# Altium project LV BMS.PrjPcb
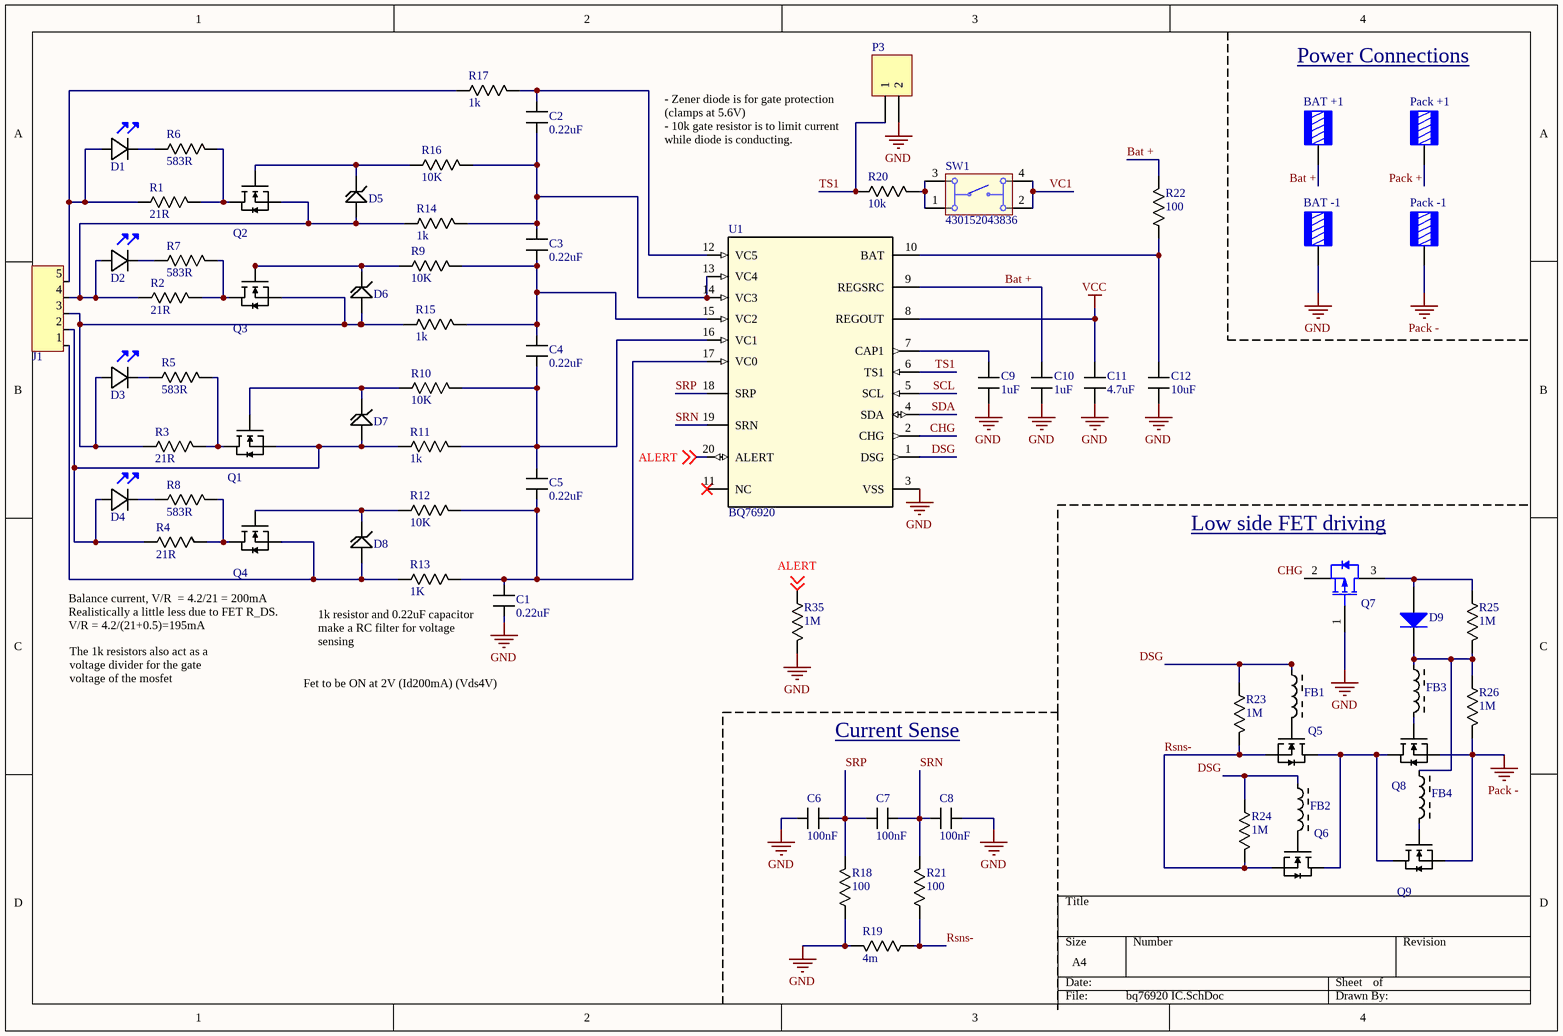
[diagram p0: bq76920 IC.SchDoc]
2 sheets, 96 parts. Net scope: global (net labels, ports and power ports of the same name join across sheets).
Board file: PCB_V1.PcbDoc
Sheets:
  bq76920 IC.SchDoc
  MCU.SchDoc

## Sheet bq76920 IC.SchDoc
size A4; SheetNumber: 1; SheetTotal: 2

### Parts
BAT_+1  7460305  [7460305]  (value not drawn)
BAT_-1  7460305  [7460305]  (value not drawn)
C1  value 0.22uF  [C_0603]  (hidden comment: C0603C224K3RECAUTO)
C2  value 0.22uF  [C_0603]  (hidden comment: C0603C224K3RECAUTO)
C3  value 0.22uF  [C_0603]  (hidden comment: C0603C224K3RECAUTO)
C4  value 0.22uF  [C_0603]  (hidden comment: C0603C224K3RECAUTO)
C5  value 0.22uF  [C_0603]  (hidden comment: C0603C224K3RECAUTO)
C6  value 100nF  [C_0603]  (hidden comment: C0603X104K5RAC7411)
C7  value 100nF  [C_0603]  (hidden comment: C0603X104K5RAC7411)
C8  value 100nF  [C_0603]  (hidden comment: C0603X104K5RAC7411)
C9  value 1uF  [C_0603]  (hidden comment: C0603C105K9RAC7411)
C10  value 1uF  [C_0603]  (hidden comment: CL10B105KA8VPNC)
C11  value 4.7uF  [C_0603]  (hidden comment: JMK107BB7475KA-T)
C12  Capacitance: 10uF  [C_0603]  (hidden comment: GRM188R6YA106MA73J)
D1  150060BS55040  [150060xS55040]  (value not drawn)
D2  150060BS55040  [150060xS55040]  (value not drawn)
D3  150060BS55040  [150060xS55040]  (value not drawn)
D4  150060BS55040  [150060xS55040]  (value not drawn)
D5  MMSZ5232BS-7-F  [MMSZ5232BS-7-F]  (value not drawn)
D6  MMSZ5232BS-7-F  [MMSZ5232BS-7-F]  (value not drawn)
D7  MMSZ5232BS-7-F  [MMSZ5232BS-7-F]  (value not drawn)
D8  MMSZ5232BS-7-F  [MMSZ5232BS-7-F]  (value not drawn)
D9  MMDL6050T1G  [ONSC-SOD-323-2-477-02_V]  (value not drawn)
FB1  BLM18SG221TN1D  [R-0603]  (value not drawn)
FB2  BLM18SG221TN1D  [R-0603]  (value not drawn)
FB3  BLM18SG221TN1D  [R-0603]  (value not drawn)
FB4  BLM18SG221TN1D  [R-0603]  (value not drawn)
J1  2-1445090-5  [2-1445090-5]  (value not drawn)
P3  For thermistor  [HDR1X2]  (value not drawn)
Pack_+1  7460305  [7460305]  (value not drawn)
Pack_-1  7460305  [7460305]  (value not drawn)
Q1  DMG1012T-13  [SOT-523-3]  (value not drawn)
Q2  DMG1012T-13  [SOT-523-3]  (value not drawn)
Q3  DMG1012T-13  [SOT-523-3]  (value not drawn)
Q4  DMG1012T-13  [SOT-523-3]  (value not drawn)
Q5  TK25S06N1L,LXHQ  [DPAK+]  (value not drawn)
Q6  TK25S06N1L,LXHQ  [DPAK+]  (value not drawn)
Q7  FDN5618P  [FAIR-SSOT3L-3_V]  (value not drawn)
Q8  TK25S06N1L,LXHQ  [DPAK+]  (value not drawn)
Q9  TK25S06N1L,LXHQ  [DPAK+]  (value not drawn)
R1  value 21R  [R_2512]  (hidden comment: CRCW251221R0FKEGHP)
R2  value 21R  [R_2512]  (hidden comment: CRCW251221R0FKEGHP)
R3  value 21R  [R_2512]  (hidden comment: CRCW251221R0FKEGHP)
R4  value 21R  [R_2512]  (hidden comment: CRCW251221R0FKEGHP)
R5  value 583R  [R-0603]  (hidden comment: RT0603DRE07583RL)
R6  value 583R  [R-0603]  (hidden comment: RT0603DRE07583RL)
R7  value 583R  [R-0603]  (hidden comment: RT0603DRE07583RL)
R8  value 583R  [R-0603]  (hidden comment: RT0603DRE07583RL)
R9  value 10K  [R-0603]  (hidden comment: CMP0603AFX-1002ELF)
R10  value 10K  [R-0603]  (hidden comment: CMP0603AFX-1002ELF)
R11  value 1k  [R-0603]  (hidden comment: CRCW06031K00FKEAC)
R12  value 10K  [R-0603]  (hidden comment: CMP0603AFX-1002ELF)
R13  value 1K  [R-0603]  (hidden comment: CRCW06031K00FKEAC)
R14  value 1k  [R-0603]  (hidden comment: CRCW06031K00FKEAC)
R15  value 1k  [R-0603]  (hidden comment: CRCW06031K00FKEAC)
R16  value 10K  [R-0603]  (hidden comment: CMP0603AFX-1002ELF)
R17  value 1k  [R-0603]  (hidden comment: CRCW06031K00FKEAC)
R18  value 100  [R-0603]  (hidden comment: RN73R1JTTD1000F50)
R19  value 4m  [PU3921FKM130R004L]  (hidden comment: PU3921FKM130R004L)
R20  value 10k  [R-0603]  (hidden comment: CMP0603AFX-1002ELF)
R21  value 100  [R-0603]  (hidden comment: RN73R1JTTD1000F50)
R22  value 100  [R-0603]  (hidden comment: RN73R1JTTD1000F50)
R23  value 1M  [R-0603]  (hidden comment: CRCW06031M00FKEAC)
R24  value 1M  [R-0603]  (hidden comment: CRCW06031M00FKEAC)
R25  value 1M  [R-0603]  (hidden comment: CRCW06031M00FKEAC)
R26  value 1M  [R-0603]  (hidden comment: CRCW06031M00FKEAC)
R35  value 1M  [R-0603]  (hidden comment: CRCW06031M00FKEAC)
SW1  430152043836  [430152043836]
U1  BQ76920  [TSSOP-20]

### Nets
GND: BAT_-1.1 C1.1 C6.2 C8.1 C9.1 C10.1 C11.1 C12.1 P3.2 Q7.1(GATE) R18.1 R19.2 R35.2 U1.3(VSS)
Pack -: Pack_-1.1 Q8.3(Source) Q9.3(Source) R26.2
VCC: C11.2 U1.8(REGOUT)
ALERT: R35.1 U1.20(ALERT) ; off-sheet ALERT
Bat +: BAT_+1.1 C10.2 R22.2 U1.9(REGSRC)
CHG: Q7.2(SOURCE) U1.2(CHG)
DSG: FB1.2 FB2.2 R23.1 R24.1 U1.1(DSG)
Pack +: Pack_+1.1
Rsns-: Q5.3(Source) Q6.3(Source) R19.1 R21.1 R23.2 R24.2
SCL: U1.5(SCL)
SDA: U1.4(SDA)
SRN: C7.1 C8.2 R21.2 U1.19(SRN)
SRP: C6.1 C7.2 R18.2 U1.18(SRP)
TS1: P3.1 R20.1 U1.6(TS1)
VC1: SW1.2 SW1.4
NetC1_2: C1.2 C5.1 R12.2 R13.2 U1.17(VC0)
NetC2_1: C2.1 C3.2 R14.2 R16.2 U1.13(VC4) U1.14(VC3)
NetC2_2: C2.2 R17.2 U1.12(VC5)
NetC3_1: C3.1 C4.2 R9.2 R15.2 U1.15(VC2)
NetC4_1: C4.1 C5.2 R10.2 R11.2 U1.16(VC1)
NetC9_2: C9.2 U1.7(CAP1)
NetC12_2: C12.2 R22.1 U1.10(BAT)
NetD1_1: D1.1(Cathode) R6.1
NetD1_2: D1.2(Anode) J1.5 R1.1 R17.1
NetD2_1: D2.1(Cathode) R7.1
NetD2_2: D2.2(Anode) D5.2(Anode_(+)) J1.4 Q2.2(Source) R2.1 R14.1
NetD3_1: D3.1(Cathode) R5.1
NetD3_2: D3.2(Anode) D6.2(Anode_(+)) J1.3 Q3.2(Source) R3.1 R15.1
NetD4_1: D4.1(Cathode) R8.1
NetD4_2: D4.2(Anode) D7.2(Anode_(+)) J1.2 Q1.2(Source) R4.1 R11.1
NetD5_1: D5.1(Cathode_(-)) Q2.1(Gate) R16.1
NetD6_1: D6.1(Cathode_(-)) Q3.1(Gate) R9.1
NetD7_1: D7.1(Cathode_(-)) Q1.1(Gate) R10.1
NetD8_1: D8.1(Cathode_(-)) Q4.1(Gate) R12.1
NetD8_2: D8.2(Anode_(+)) J1.1 Q4.2(Source) R13.1
NetD9_1: D9.1(K) FB3.2 FB4.2 R25.2 R26.1
NetD9_2: D9.2(A) Q7.3(DRAIN) R25.1
NetFB1_1: FB1.1 Q5.1(Gate)
NetFB2_1: FB2.1 Q6.1(Gate)
NetFB3_1: FB3.1 Q8.1(Gate)
NetFB4_1: FB4.1 Q9.1(Gate)
NetQ1_3: Q1.3(Drain) R3.2 R5.2
NetQ2_3: Q2.3(Drain) R1.2 R6.2
NetQ3_3: Q3.3(Drain) R2.2 R7.2
NetQ4_3: Q4.3(Drain) R4.2 R8.2
NetQ5_2: Q5.2(Drain) Q6.2(Drain) Q8.2(Drain) Q9.2(Drain)
NetR20_2: R20.2 SW1.1 SW1.3

Not connected (* = marked no-connect by the designer): U1 11(NC)*

### Notes on the sheet
- Power Connections
- - Zener diode is for gate protection (clamps at 5.6V)
  - 10k gate resistor is to limit current while diode is conducting.
- (near Q7) Low side FET driving
- Balance current, V/R  = 4.2/21 = 200mA
  Realistically a little less due to FET R_DS.
  V/R = 4.2/(21+0.5)=195mA
- 1k resistor and 0.22uF capacitor make a RC filter for voltage sensing
- The 1k resistors also act as a voltage divider for the gate voltage of the mosfet
- Fet to be ON at 2V (Id200mA) (Vds4V)
- Current Sense

### Library data of the parts
BAT_+1 BAT_-1 Pack_+1 Pack_-1 = 7460305: WP-BUTR Press-Fit with Internal thread, two rows, 9x9mm, 8 pins, M5x6mm, 160A; Pin Number: 8; Thread Length: 6mm; Thread: M5; Surface: Tin; ComponentLink1Description: Manufacturer; ComponentLink1URL: http://www.we-online.de; ComponentLink2Description: Datasheet; ComponentLink2URL: https://katalog.we-online.com/em/datasheet/7460305.pdf; Operating Temperature: -55 to +150degC; Height: 7mm; Material: Brass; Part Number: 7460305; Packaging: Bulk; Mounting Technology: Press-Fit; Rated Current: 160A; Publisher: Wurth Elektronik; Published Date: September 2019; Size: 9x9mm
C1-C5 = Capacitor: Cap Ceramic 0.22uF 25V X7R 10% Pad SMD 0603 125C Automotive T/R; Manufacturer: KEMET; Capacitance: 220nF; Supplier 1: Mouser; Supplier Part Number 1: 80-C0603C224K3REAUTO; Manufacturer Part Number: C0603C224K3RECAUTO; RoHS: Yes; Category: Ceramic Capacitors; Stock 1: 9648; Pricing 1: 1=0.27000, 10=0.12200, 50=0.12200, 100=0.10400, 1000=0.06400, 10000=0.05300 (USD); Mount: Surface Mount; Case/Package: 0603; Case Code (Imperial): 0603; Case Code (Metric): 1608; Min Operating Temperature: -55°C; Max Operating Temperature: 125°C; Packaging: Tape and Reel; Tolerance: 10%; Voltage Rating: 25V; Ratings: AEC-Q200; RoHS Compliant: Yes; ComponentLink1URL: http://www.farnell.com/datasheets/2314375.pdf?src-supplier=Farnell; ComponentLink1Description: http://www.farnell.com/datasheets/2314375.pdf?src-supplier=Farnell; ComponentLink2URL: https://api.kemet.com/component-edge/download/datasheet/C0603C224K3RECAUTO.pdf?src-supplier=Digi-Key; ComponentLink2Description: https://api.kemet.com/component-edge/download/datasheet/C0603C224K3RECAUTO.pdf?src-supplier=Digi-Key
C6-C8 = Capacitor: CAP CER 0.1UF 50V X7R 0603; Manufacturer: KEMET; Dielectric Material: Ceramic; Tolerance: 10%; Supplier 1: RSComponents; Supplier Part Number 1: 2053261; Manufacturer Part Number: C0603X104K5RAC7411; RoHS: Yes; Category: Ceramic Capacitors; Stock 1: 28600; Pricing 1: 15000=0.02900, 45000=0.02700 (USD); Mount: Surface Mount; Case/Package: 0603; Case Code (Metric): 1608; Case Code (Imperial): 0603; Min Operating Temperature: -55°C; Max Operating Temperature: 125°C; Capacitance: 100nF; Voltage Rating: 50V; Package Quantity: 1; Packaging: Cut Tape; Voltage Rating (DC): 50V; Features: Soft Termination; Length: 0.064inch; Width: 0.032inch; Thickness: 0.034inch; RoHS Compliant: Yes; ComponentLink1URL: https://api.kemet.com/component-edge/download/datasheet/C0603X104K5RAC7411.pdf?src-supplier=Digi-Key; ComponentLink1Description: https://api.kemet.com/component-edge/download/datasheet/C0603X104K5RAC7411.pdf?src-supplier=Digi-Key; ComponentLink2URL: http://www.farnell.com/datasheets/2747793.pdf?src-supplier=Newark; ComponentLink2Description: http://www.farnell.com/datasheets/2747793.pdf?src-supplier=Newark
C9 = Capacitor: Manufacturer: KEMET; ComponentLink1Description: New link; ComponentLink1URL: *; Supplier 1: Mouser; Supplier Part Number 1: 80-C0603C105K9R7411; Manufacturer Part Number: C0603C105K9RAC7411; RoHS: Yes; Stock 1: 22545; Pricing 1: 1=0.25000, 10=0.10200, 50=0.10200, 100=0.08700, 1000=0.05300, 10000=0.04400 (USD); RoHS Compliant: Yes
C10 = Capacitor: Cap Ceramic 1uF 25V X7R 10% Pad SMD 0603 125°C Automotive T/R; Manufacturer: KEMET; Manufacturer Part Number: C0603C105K9RAC7411; ComponentLink1Description: New link; ComponentLink1URL: *; Supplier 1: Mouser; Supplier Part Number 1: 80-C0603C105K9R7411; RoHS: Yes; Stock 1: 22545; Pricing 1: 1=0.25000, 10=0.10200, 50=0.10200, 100=0.08700, 1000=0.05300, 10000=0.04400 (USD); RoHS Compliant: Yes; Supplier 2: Mouser; Supplier Part Number 2: 187-CL10B105KA8VPNC; Category: Ceramic Capacitors; Stock 2: 72139; Pricing 2: 1=0.20000, 10=0.14500, 50=0.14500, 100=0.06900, 1000=0.04200, 10000=0.04000 (USD); Mount: Surface Mount; Case/Package: 0603; Case Code (Metric): 1608; Case Code (Imperial): 0603; Min Operating Temperature: -55°C; Max Operating Temperature: 125°C; Packaging: Tape and Reel; Capacitance: 1uF; Voltage Rating: 25V; Tolerance: 10%; Features: Soft Termination; Length: 0.063inch; Width: 0.031inch; Thickness: 0.035inch; Ratings: AEC-Q200; ComponentLink2URL: http://www.samsungsem.com/global/front/downloadcms.do?path=%2F%2Fglobal%2F%2Fsupport%2F%2Fproduct-search%2F%2Fmlcc%2F%2F__icsFiles%2F%2Fafieldfile%2F%2F2017%2F%2F05%2F%2F25&fileName=CL10B105KA8VPNC.pdf&src-supplier=Digi-Key; ComponentLink2Description: http://www.samsungsem.com/global/front/downloadcms.do?path=%2F%2Fglobal%2F%2Fsupport%2F%2Fproduct-search%2F%2Fmlcc%2F%2F__icsFiles%2F%2Fafieldfile%2F%2F2017%2F%2F05%2F%2F25&fileName=CL10B105KA8VPNC.pdf&src-supplier=Digi-Key; ComponentLink3URL: http://www.samsungsem.com/servlet/FileDownload?filename=productcatalog/pdf/MLCC.pdf&src-supplier=Avnet; ComponentLink3Description: http://www.samsungsem.com/servlet/FileDownload?filename=productcatalog/pdf/MLCC.pdf&src-supplier=Avnet
C11 = Capacitor: Cap Ceramic 4.7uF 6.3V X7R 10% Pad SMD 0603 125°C T/R; Manufacturer: Taiyo Yuden; ComponentLink1Description: New link; ComponentLink1URL: *; Supplier 1: Mouser; Supplier Part Number 1: 963-JMK107BB7475KA-T; Manufacturer Part Number: JMK107BB7475KA-T; RoHS: Yes; Category: Ceramic Capacitors; Stock 1: 75256; Pricing 1: 1=0.30000, 10=0.16700, 50=0.16700, 100=0.12200, 1000=0.10700, 10000=0.10100 (USD); Mount: Surface Mount; Case/Package: 0603; Case Code (Imperial): 0603; Case Code (Metric): 1608; Min Operating Temperature: -55°C; Max Operating Temperature: 125°C; Packaging: Cut Tape; Capacitance: 4.7uF; Tolerance: 10%; Voltage Rating: 6.3V; Lead Free: Lead Free; RoHS Compliant: Yes; ComponentLink2URL: http://www.farnell.com/datasheets/2801343.pdf?src-supplier=Farnell; ComponentLink2Description: http://www.farnell.com/datasheets/2801343.pdf?src-supplier=Farnell; ComponentLink3URL: http://ds.yuden.co.jp/TYCOMPAS/ut/detail.do?productNo=JMK107BB7475KA-T&fileName=JMK107BB7475KA-T_SS&mode=specSheetDownload&src-supplier=Digi-Key; ComponentLink3Description: http://ds.yuden.co.jp/TYCOMPAS/ut/detail.do?productNo=JMK107BB7475KA-T&fileName=JMK107BB7475KA-T_SS&mode=specSheetDownload&src-supplier=Digi-Key; ComponentLink4URL: https://ds.yuden.co.jp/TYCOMPAS/ut/detail?pn=JMK107BB7475KA-T &u=M&src-supplier=Digi-Key; ComponentLink4Description: https://ds.yuden.co.jp/TYCOMPAS/ut/detail?pn=JMK107BB7475KA-T &u=M&src-supplier=Digi-Key; ComponentLink5URL: http://www.farnell.com/datasheets/2801343.pdf?src-supplier=Element14; ComponentLink5Description: http://www.farnell.com/datasheets/2801343.pdf?src-supplier=Element14; ComponentLink6URL: http://www.farnell.com/datasheets/2801343.pdf?src-supplier=Newark; ComponentLink6Description: http://www.farnell.com/datasheets/2801343.pdf?src-supplier=Newark
C12 = Capacitor: CAP CER 10UF X5R 0603; Manufacturer: Murata; Tolerance: 20%; Voltage Rating: 35V; Supplier 1: Mouser; Supplier Part Number 1: 81-GRM188R6YA106MA3J; Manufacturer Part Number: GRM188R6YA106MA73J; RoHS: Yes; Category: Ceramic Capacitors; Stock 1: 9408; Pricing 1: 1=0.43000, 10=0.21100, 50=0.21100, 100=0.18100, 1000=0.11500, 10000=0.09300 (USD); Mount: Surface Mount; Case/Package: 0603; Min Operating Temperature: -55°C; Max Operating Temperature: 85°C; Packaging: Tape and Reel; RoHS Compliant: Yes; ComponentLink1URL: https://search.murata.co.jp/Ceramy/image/img/A01X/G101/ENG/GRM188R6YA106MA73-01A.pdf?src-supplier=Digi-Key; ComponentLink1Description: https://search.murata.co.jp/Ceramy/image/img/A01X/G101/ENG/GRM188R6YA106MA73-01A.pdf?src-supplier=Digi-Key
D1-D4 = 150060BS55040: LED BLUE DIFFUSED 0603 SMD; Manufacturer: Wurth Electronics; Lens Style: Flat; Luminous Intensity: 80mcd; Forward Voltage: 3.2V; Test Current: 20mA; Viewing Angle: 140°; Dominant Wavelength: 470nm; Lens Size: 0.8mm; Supplier 1: Mouser; Manufacturer Part Number: 150060BS55040; RoHS: No; Pricing 1: 1=0.18000, 10=0.16200, 50=0.13200, 100=0.11700, 1000=0.08800, 10000=0.08800 (USD); Mount: Surface Mount; Case/Package: 0603; Color: Blue; Packaging: Tape and Reel; Lens Transparency: Diffused; Length: 1.6mm; Width: 0.8mm; Height: 0.5mm; RoHS Compliant: No; ComponentLink1URL: http://www.farnell.com/datasheets/2621640.pdf?src-supplier=Farnell; ComponentLink1Description: http://www.farnell.com/datasheets/2621640.pdf?src-supplier=Farnell; ComponentLink2URL: https://www.we-online.de/web/en/index.php/download/media/07_electronic_components/download_center_1/application_notes_berichte/ano002_leds___the_future_of_horticultural_lighting/ANO002b_EN_LEDs_The_Future_of_Horticultural_Lighting.pdf?src-supplier=Digi-Key; ComponentLink2Description: https://www.we-online.de/web/en/index.php/download/media/07_electronic_components/download_center_1/application_notes_berichte/ano002_leds___the_future_of_horticultural_lighting/ANO002b_EN_LEDs_The_Future_of_Horticultural_Lighting.pdf?src-supplier=Digi-Key; ComponentLink3URL: https://katalog.we-online.de/pbs/datasheet/150060BS55040.pdf?src-supplier=Digi-Key; ComponentLink3Description: https://katalog.we-online.de/pbs/datasheet/150060BS55040.pdf?src-supplier=Digi-Key; Supplier Part Number 1: 710-150060BS55040
D5-D8 = MMSZ5232BS-7-F: Balance Diode / MMSZ5232BS-7-F
D9 = CMP-1054-00066-1: Switching Diode, 2-Pin SOD-323, Pb-Free, Tape and Reel; Manufacturer: On Semiconductor; trr Max (ns): 4; Configuration: Single; IF Max (A): 0.2; ComponentLink2Description: Datasheet; ComponentLink3URL: http://www.onsemi.com/pub_link/Collateral/477-02.PDF.1; PackageVersion: Rev. H, 03/2007; Mounting Technology: Surface Mount; Packing: Tape and Reel; ComponentLink1URL: http://www.onsemi.com/; ComponentLink1Description: Manufacturer URL; PartNumber: MMDL6050T1G; PackageDescription: 2-Pin SOD, Body 1.7 x 1.25 mm; ComponentLink2URL: http://www.onsemi.cn/pub_link/Collateral/MMDL6050T1-D.PDF; DatasheetVersion: Rev. 5; PackageReference: SOD-323-2-477-02; ComponentLink3Description: Package Specification; RoHS: TRUE
FB1-FB4 = BLM18SG221TN1D: FERRITE BEAD 220 OHM 0603 1LN; Manufacturer: Murata; Material: Ferrite,Steel; Impedance: 220R; Tolerance: 25%; DC Resistance (DCR): 40mR; Max DC Current: 2.5A; Number of Lines: 1; Test Frequency: 100MHz; Supplier 1: Mouser; Manufacturer Part Number: BLM18SG221TN1D; RoHS: Yes; Category: Inductors; Stock 1: 126991; Pricing 1: 1=0.13000, 10=0.07500, 50=0.07500, 100=0.05100, 1000=0.03800, 10000=0.03000 (USD); Case/Package: 0603; Number of Pins: 2; Core Material: Ferrite; Case Code (Metric): 1608; Case Code (Imperial): 0603; Weight: 7.1E-05oz; Min Operating Temperature: -55°C; Max Operating Temperature: 125°C; Package Quantity: 1; Max Current Rating: 2.5A; Packaging: Tape and Reel; Current Rating: 2.5A; Termination: SMD/SMT; DC Current: 2.5A; Number of Circuits: 1; Series: BLM18S; DC Resistance-Max: 40mR; Length: 1.6mm; Width: 0.8mm; Height: 0.8mm; Depth: 0.95mm; Radiation Hardening: No; REACH SVHC: No SVHC; Lead Free: Lead Free; RoHS Compliant: Yes; Supplier Part Number 1: 81-BLM18SG221TN1D
J1 = 2-1445090-5: Micro MATE-N-LOK, Rectangular Power Connectors, Header, Plug, Wire-to-Board, 5 Position, 3mm [.118in] Centerline, Printed Circuit Board, UL 94V-0; Manufacturer: TE Connectivity; Number of Positions: 5; Connector Type: Pin; Mating Retention: Yes (With); PCB Mount Alignment: No (Without); VDE Tested: Yes; PCB Mount Retention: With; PCB Mounting Orientation: Right Angle; Contact Current Rating: 5A; Pitch: 0.118inch; Plating Thickness: 2.54um; PCB Thickness: 0.062mm; Approvals: CSA; Supplier 1: Mouser; Manufacturer Part Number: 2-1445090-5; RoHS: Yes; Category: Connectors; Stock 1: 62; Pricing 1: 1=1.73000, 10=1.41000, 50=1.41000, 100=1.22000, 1000=0.95800, 10000=0.77900 (USD); Mount: Surface Mount; Color: Black; Contact Material: Brass; Housing Color: Black; Housing Material: Nylon; Contact Plating: Gold,Tin; Min Operating Temperature: -40°C; Max Operating Temperature: 221°C; Packaging: Tray; Package Quantity: 215; Number of Rows: 1; Fastening Type: Ramp; Termination: SMD/SMT; Number of Contacts: 5; Orientation: Right Angle; Series: Micro MATE-N-LOK; Contact Type: Male Pin; Connector System: Wire-to-Board; Contact Retention: No (Without); Sealable: No (Without); Circuit Application: Power; Mating Alignment: Yes (With); Number of Power Positions: 5; Strain Relief: No (Without); Length: 19mm; Width: 3.86mm; Height: 8.11mm; Insulation Diameter: 3mm; Radiation Hardening: No; Lead Free: Lead Free; ELV: Compliant; Flammability Rating: UL94 V-0; RoHS Compliant: Yes; ComponentLink1URL: https://datasheet.ciiva.com/9441/eng-cs-82181-softshell-high-density-0508-9441612.pdf?src-supplier=Avnet; ComponentLink1Description: https://datasheet.ciiva.com/9441/eng-cs-82181-softshell-high-density-0508-9441612.pdf?src-supplier=Avnet; ComponentLink2URL: https://datasheet.ciiva.com/729/eng-cd-1445090-b-729471.pdf?src-supplier=Digi-Key; ComponentLink2Description: https://datasheet.ciiva.com/729/eng-cd-1445090-b-729471.pdf?src-supplier=Digi-Key; Supplier Part Number 1: 571-2-1445090-5
P3 = Header 2: Header, 2-Pin; LatestRevisionDate: 17-Jul-2002; LatestRevisionNote: Re-released for DXP Platform.; Publisher: Altium Limited
Q1-Q4 = DMG1012T-13: Trans Mosfet N-ch 20V 0.63A 3-PIN SOT-523 T/r; Manufacturer: Diodes; Continuous Drain Current (ID): 630mA; Rds On Max: 400mR; Input Capacitance: 60.67pF; Max Power Dissipation: 280mW; Supplier 1: Mouser; Manufacturer Part Number: DMG1012T-13; RoHS: Yes; Stock 1: 11363; Pricing 1: 1=0.41000, 10=0.19900, 50=0.19900, 100=0.09600, 1000=0.05700, 10000=0.03900 (USD); Mount: Surface Mount; Case/Package: SOT-523; Min Operating Temperature: -55°C; Max Operating Temperature: 150°C; Packaging: Tape and Reel; Drain to Source Voltage (Vdss): 20V; Supplier Part Number 1: 621-DMG1012T-13
Q5 Q6 Q8 Q9 = TK25S06N1L,LXHQ: MOSFET 57W 1MHz Automotive; AEC-Q101; Manufacturer Part Number: TK25S06N1L,LQ(O; Manufacturer: Toshiba; Category: MOSFETs; RoHS: No; Stock 1: 5332; Pricing 1: 1=0.89000, 10=0.75400, 50=0.75400, 100=0.56000, 1000=0.39100, 10000=0.33300 (USD); Case/Package: DPAK+; Supplier 1: Digi-Key; Supplier Part Number 1: 264-TK25S06N1LLXHQCT-ND
Q7 = CMP-2000-06255-1: P-Channel Logic Level PowerTrench(R) MOSFET, -60 V, -1.25 A, 3-Pin SOT23, RoHS, Tape and Reel; Manufacturer: Fairchild Semiconductor; Current Temperature: 25°C; Voltage Vgs Max: 20V; Package Version: Rev. 3, 05/2015; Continuous Drain Current Id: 1.25A; Current Id Max: 1.2A; Voltage Vds: 60V; Pulse Current Idm: 10A; On Resistance Rds(on): 170mohm; Transistor Case Style: SOT-23; Voltage Vgs th Max: -3V; Rds(on) Test Voltage Vgs: -10V; Device Marking: 618; External Depth: 2.5mm; Transistor Polarity: PChannel; SVHC: NoSVHC(19-Dec-2012); External Width: 3.05mm; External Length / Height: 1.12mm; Power Dissipation Pd: 500mW; Voltage Vds Typ: -60V; No. of Pins: 3; Package / Case: SOT-23; Manufacturer URL: https://www.fairchildsemi.com/; Package Reference: SSOT3L; Operating Temperature Max: 150°C; Tape Width: 8mm; Package URL: https://www.fairchildsemi.com/package-drawings/MA/MA03B.pdf; Datasheet URL: https://www.fairchildsemi.com/datasheets/FD/FDN5618P.pdf; MSL: –; Operating Temperature Min: -55°C; Package Description: 3-Pin Small Outline Transistor, Body 2.92 x 1.4 mm, Pitch 0.95 mm; Datasheet Version: Rev. C, 10/2000; Threshold Voltage Vgs Typ: 20V; Drain Source Voltage Vds: 60V; SMD Marking: 618; Full Power Rating Temperature: 25°C; Mounting Technology: SurfaceMount; Voltage Vgs Rds on Measurement: -10V; Operating Temperature Range: -55°Cto+150°C
R1-R4 = Resistor: RES SMD 21 OHM 1% 1.5W 2512; Manufacturer: Vishay Dale; Temperature Coefficient: 100ppm/°C; Supplier 1: Mouser; Supplier Part Number 1: 71-CRCW251221R0FKEGH; Manufacturer Part Number: CRCW251221R0FKEGHP; RoHS: Yes; Category: Chip SMD Resistors; Stock 1: 1060; Pricing 1: 1=0.71000, 10=0.58900, 50=0.58900, 100=0.39600, 1000=0.23700, 10000=0.20600 (USD); Case/Package: 2512; Min Operating Temperature: -55°C; Max Operating Temperature: 155°C; Resistance: 21R; Package Quantity: 2000; Packaging: Tape and Reel; Tolerance: 1%; Resistor Type: Thick Film; Number of Terminations: 2; Max Power Dissipation: 1.5W; Features: Automotive AEC-Q200; Series: CRCW-HP; Length: 0.248inch; Width: 0.124inch; Height: 0.028inch; Lead Free: Lead Free; RoHS Compliant: Yes; ComponentLink1URL: http://www.vishay.com/docs/20043/crcwhpe3.pdf?src-supplier=Digi-Key; ComponentLink1Description: http://www.vishay.com/docs/20043/crcwhpe3.pdf?src-supplier=Digi-Key
R5-R8 = Resistor: High Precision-High Stability Chip Resistor Thin Film 0603 583Ohm 0.5% Paper T/R; Manufacturer: Yageo; Max Power Dissipation: 100mW; Temperature Coefficient: 50ppm/°C; Supplier 1: Mouser; Supplier Part Number 1: 603-RT0603DRE07583RL; Manufacturer Part Number: RT0603DRE07583RL; RoHS: Yes; Category: Chip SMD Resistors; Stock 1: 17347; Pricing 1: 1=0.14000, 10=0.07400, 50=0.07400, 100=0.02600, 1000=0.01900, 10000=0.01200 (USD); Case/Package: 0603; Min Operating Temperature: -55°C; Max Operating Temperature: 155°C; Resistor Type: Thin Film; Packaging: Tape and Reel; Number of Terminations: 2; Resistance: 583R; Tolerance: 0.5%; ComponentLink1URL: http://www.yageo.com/documents/recent/PYu-RT_1-to-0.01_RoHS_L_9.pdf?src-supplier=Digi-Key; ComponentLink1Description: http://www.yageo.com/documents/recent/PYu-RT_1-to-0.01_RoHS_L_9.pdf?src-supplier=Digi-Key
R9 R10 R12 R16 R20 = Resistor: Manufacturer: Bourns; Supplier 1: Mouser; Supplier Part Number 1: 652-CMP0603AFX-1002L; Manufacturer Part Number: CMP0603AFX-1002ELF; RoHS: No; Stock 1: 10216; Pricing 1: 1=0.21000, 10=0.09200, 50=0.09200, 100=0.05300, 1000=0.02900, 10000=0.02200 (USD)
R11 R13-R15 R17 = Resistor: VISHAY - CRCW06031K00FKEA - SMD Chip Resistor, 0603 [1608 Metric], 1 kohm, CRCW e3 Series, 75 V, Thick Film, 100 mW; Manufacturer: Vishay Dale; Resistance: 1kR; Power Rating: 100mW; Tolerance: 1%; Temperature Coefficient: 100ppm/°C; Voltage Rating: 75V; Supplier 1: RSComponents; Supplier Part Number 1: 1694265; Manufacturer Part Number: CRCW06031K00FKEA; RoHS: Yes; Category: Chip SMD Resistors; Stock 1: 30000; Pricing 1: 5000=0.00500, 10000=0.00400, 20000=0.00400 (USD); Mount: Surface Mount; Case/Package: 0603; Number of Pins: 2; Contact Plating: Tin; Weight: 7.1E-05oz; Case Code (Metric): 1608; Case Code (Imperial): 0603; Size Code: 0603; Min Operating Temperature: -55°C; Max Operating Temperature: 155°C; Resistor Type: Thick Film; Termination: SMD/SMT; Packaging: Tape and Reel; Package Quantity: 10; Number of Terminations: 2; Max Power Dissipation: 100mW; Voltage Rating (DC): 75V; Features: Automotive AEC-Q200; Series: CRCW; Technology: THICK FILM; Construction: Rectangular; Resistance Tolerance: 1%; Length: 1.55mm; Width: 0.033inch; Height: 0.45mm; Depth: 0.85mm; Radiation Hardening: No; Lead Free: Lead Free; RoHS Compliant: Yes; REACH SVHC: Unknown; Military Standard: Not; ComponentLink1URL: https://datasheet.ciiva.com/11808/0900766b80d98afc-11808625.pdf?src-supplier=RSComponents; ComponentLink1Description: https://datasheet.ciiva.com/11808/0900766b80d98afc-11808625.pdf?src-supplier=RSComponents; ComponentLink2URL: https://datasheet.ciiva.com/8336/dcrcwe3-8336822.pdf?src-supplier=Avnet; ComponentLink2Description: https://datasheet.ciiva.com/8336/dcrcwe3-8336822.pdf?src-supplier=Avnet; ComponentLink3URL: https://datasheet.ciiva.com/16515/dcrcwe3-16515078.pdf?src-supplier=Avnet+Asia; ComponentLink3Description: https://datasheet.ciiva.com/16515/dcrcwe3-16515078.pdf?src-supplier=Avnet+Asia; ComponentLink4URL: https://datasheet.ciiva.com/3257/dcrcwe3-3257132.pdf?src-supplier=Avnet; ComponentLink4Description: https://datasheet.ciiva.com/3257/dcrcwe3-3257132.pdf?src-supplier=Avnet; ComponentLink5URL: https://datasheet.ciiva.com/2465/dcrcwe3-2465534.pdf?src-supplier=Digi-Key; ComponentLink5Description: https://datasheet.ciiva.com/2465/dcrcwe3-2465534.pdf?src-supplier=Digi-Key; ComponentLink6URL: https://datasheet.ciiva.com/16893/dcrcwe3-16893742.pdf?src-supplier=Avnet+Europe; ComponentLink6Description: https://datasheet.ciiva.com/16893/dcrcwe3-16893742.pdf?src-supplier=Avnet+Europe; ComponentLink7URL: https://datasheet.ciiva.com/2465/dcrcwe3-2465535.pdf?src-supplier=Digi-Key; ComponentLink7Description: https://datasheet.ciiva.com/2465/dcrcwe3-2465535.pdf?src-supplier=Digi-Key; ComponentLink8URL: https://datasheet.ciiva.com/2465/dcrcwe3-2465536.pdf?src-supplier=Digi-Key; ComponentLink8Description: https://datasheet.ciiva.com/2465/dcrcwe3-2465536.pdf?src-supplier=Digi-Key; ComponentLink9URL: https://datasheet.ciiva.com/26316/fld-crcw-e3-data-en-26316551.pdf?src-supplier=Distrelec; ComponentLink9Description: https://datasheet.ciiva.com/26316/fld-crcw-e3-data-en-26316551.pdf?src-supplier=Distrelec; ComponentLink10URL: https://datasheet.ciiva.com/46441/1720486-46441623.pdf?src-supplier=Element14; ComponentLink10Description: https://datasheet.ciiva.com/46441/1720486-46441623.pdf?src-supplier=Element14; ComponentLink11URL: https://datasheet.ciiva.com/46441/1720486-46441622.pdf?src-supplier=Element14; ComponentLink11Description: https://datasheet.ciiva.com/46441/1720486-46441622.pdf?src-supplier=Element14; ComponentLink12URL: https://datasheet.ciiva.com/46385/1697337-46385497.pdf?src-supplier=Element14; ComponentLink12Description: https://datasheet.ciiva.com/46385/1697337-46385497.pdf?src-supplier=Element14; ComponentLink13URL: https://datasheet.ciiva.com/16199/dcrcwe3-16199053.pdf?src-supplier=Future+Electronics; ComponentLink13Description: https://datasheet.ciiva.com/16199/dcrcwe3-16199053.pdf?src-supplier=Future+Electronics
R18 R21 R22 = Resistor: Manufacturer: KOA Speer; Supplier 1: Mouser; Supplier Part Number 1: 660-RN73R1JTD1000F50; Manufacturer Part Number: RN73R1JTTD1000F50; RoHS: No; Stock 1: 4124; Pricing 1: 1=0.20000, 10=0.20000, 50=0.15200, 100=0.11800, 1000=0.07700, 10000=0.04700 (USD)
R19 = Resistor: Res Metal Plate 3921 0.004 Ohm 1% 3W ±75ppm/C Pad SMD Automotive T/R; Manufacturer: Yageo; Resistance: 4mR; Temperature Coefficient: 75ppm/°C; Supplier 1: Mouser; Supplier Part Number 1: 603-PU3921FKM130R004; Manufacturer Part Number: PU3921FKM130R004L; RoHS: Yes; Category: Chip SMD Resistors; Stock 1: 2383; Pricing 1: 1=1.40000, 10=1.14000, 50=1.14000, 100=0.75800, 1000=0.53100, 10000=0.45200 (USD); Case/Package: 3921; Min Operating Temperature: -65°C; Max Operating Temperature: 170°C; Packaging: Tape and Reel; Resistor Type: Metal Element; Number of Terminations: 2; Tolerance: 1%; Max Power Dissipation: 3W; Features: Moisture Resistant,Automotive AEC-Q200; Length: 0.394inch; Width: 0.205inch; Height: 0.019inch; RoHS Compliant: Yes; ComponentLink1URL: http://www.yageo.com/documents/recent/PYu-PU_51_RoHS_L_3.pdf?src-supplier=Digi-Key; ComponentLink1Description: http://www.yageo.com/documents/recent/PYu-PU_51_RoHS_L_3.pdf?src-supplier=Digi-Key
R23-R26 R35 = Resistor: Manufacturer: Vishay; Power Rating: 100mW; Resistance: 1MR; Temperature Coefficient: 100ppm/°C; Tolerance: 1%; Case/Package: Molded; Category: Chip SMD Resistors; Contact Plating: Tin; Lead Free: Lead Free; Length: 1.55mm; Manufacturer Part Number: CRCW06031M00FKEAC; Max Operating Temperature: 155°C; Min Operating Temperature: -55°C; Mount: Surface Mount; Resistor Type: Thick Film; RoHS Compliant: Yes; Termination: Wraparound
SW1 = CMP-1452-00002-1: WS-TASV SMD Tact Switch 6X6 mm; Manufacturer: Wuerth Elektronik; NoPins: 04; PartNumber: 430152043836; ComponentLink2URL: http://katalog.we-online.de/em/datasheet/4301x2.pdf; ComponentLink1URL: http://www.we-online.com; ComponentLink2Description: Datasheet; ComponentLink1Description: Manufacturer URL; PackageReference: 430152043836
U1 = BQ76920: 3 to 5-Series Cell Li-Ion and Li-Phosphate Battery Monitor; Manufacturer: Texas Instruments; Manufacturer Part Number: BQ7692003PWR; Fault Protection: Over Current,Short Circuit,Over/Under Voltage; Interface: I2C; Operating Supply Voltage: 25V; Output Voltage: 3.6V; Supplier 1: Mouser; Case/Package: TSSOP; Category: Battery Management; Contact Plating: Gold; Lead Free: Lead Free; Max Operating Temperature: 85°C; Min Operating Temperature: -40°C; Mount: Surface Mount; Number of Pins: 20; Package Quantity: 2000; Packaging: Tape and Reel; RoHS Compliant: Yes; Weight: 0.002758oz; Supplier Part Number 1: 595-BQ7692003PWR

## Sheet MCU.SchDoc
size A4; SheetNumber: 2; SheetTotal: 2
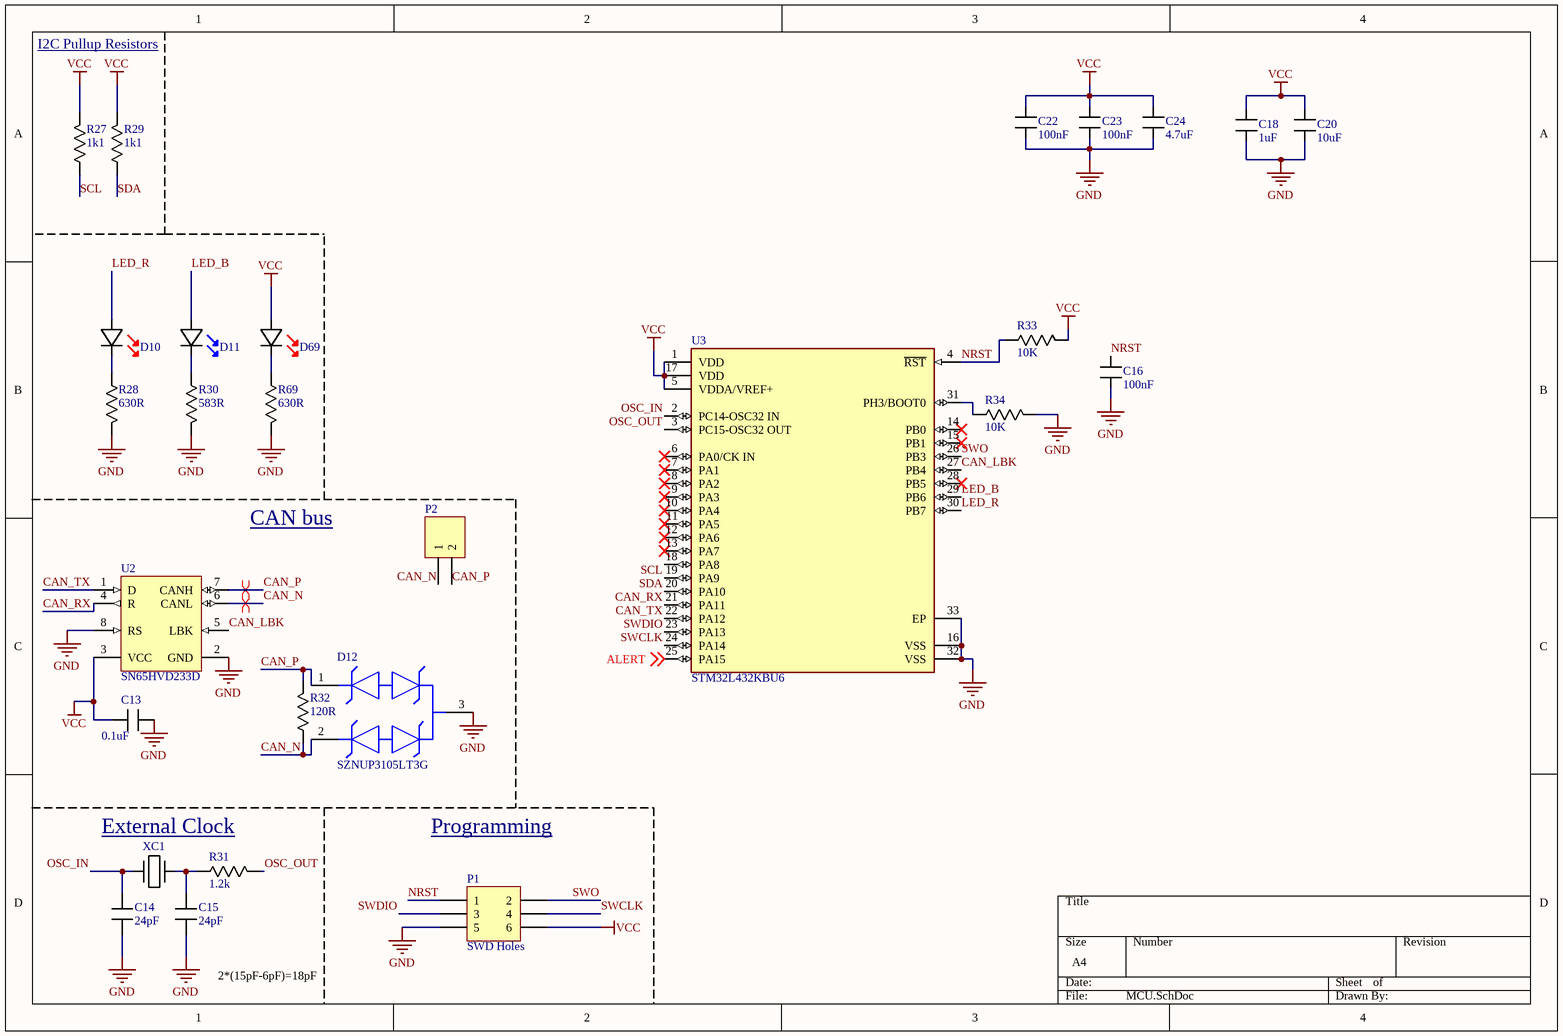
[diagram p1: MCU.SchDoc]

### Parts
C13  value 0.1uF  [C_0603]  (hidden comment: 06035C104JAT4A)
C14  value 24pF  [C_0603]  (hidden comment: 06031U240FAT2A)
C15  value 24pF  [C_0603]  (hidden comment: 06031U240FAT2A)
C16  value 100nF  [C_0603]  (hidden comment: C0603X104K5RAC7411)
C18  value 1uF  [C_0603]  (hidden comment: C0603C105K9RAC7411)
C20  value 10uF  [C_0603]  (hidden comment: JMK107ABJ106KAHT)
C22  value 100nF  [C_0603]  (hidden comment: C0603X104K5RAC7411)
C23  value 100nF  [C_0603]  (hidden comment: C0603X104K5RAC7411)
C24  value 4.7uF  [C_0603]  (hidden comment: JMK107BB7475KA-T)
D10  150060RS55040  [150060xS55040]  (value not drawn)
D11  150060BS55040  [150060xS55040]  (value not drawn)
D12  SZNUP3105LT3G  [FP-318-08-MFG]
D69  150060RS55040  [150060xS55040]  (value not drawn)
P1  SWD Holes  [2*3 2.54mm header]
P2  Nothing  [2x1 2.54MM PITCH]  (value not drawn)
R27  value 1k1  [R-0603]  (hidden comment: CRCW06031K10JNEAC)
R28  value 630R  [R-0603]  (hidden comment: RT0603DRE07583RL)
R29  value 1k1  [R-0603]  (hidden comment: CRCW06031K10JNEAC)
R30  value 583R  [R-0603]  (hidden comment: RT0603DRE07583RL)
R31  value 1.2k  [R-0603]  (hidden comment: Resistor)
R32  value 120R  [R-0603]  (hidden comment: Dont populate)
R33  value 10K  [R-0603]  (hidden comment: CMP0603AFX-1002ELF)
R34  value 10K  [R-0603]  (hidden comment: CMP0603AFX-1002ELF)
R69  value 630R  [R-0603]  (hidden comment: RT0603DRE07583RL)
U2  SN65HVD233D  [D0008A_N]
U3  STM32L432KBU6  [FP-UFQFPN32-A0B8-MFG]
XC1  ATS600BSM-1E  [ATS600BSM-1E]  (value not drawn)

### Nets
GND: C13.1 C14.1 C15.1 C16.1 C18.1 C20.1 C22.1 C23.1 C24.1 D12.3 P1.5 R28.2 R30.2 R34.2 R69.2 U2.2(GND) U2.8(RS) U3.16(VSS) U3.32(VSS) U3.33(EP)
VCC: C13.2 C18.2 C20.2 C22.2 C23.2 C24.2 D69.2(Anode) P1.6 R27.2 R29.2 R33.2 U2.3(VCC) U3.1(VDD) U3.5(VDDA/VREF+) U3.17(VDD)
ALERT: U3.25(PA15) ; off-sheet ALERT
CAN_LBK: U2.5(LBK) U3.27(PB4)
CAN_N: D12.2 P2.1 R32.1 U2.6(CANL)
CAN_P: D12.1 P2.2 R32.2 U2.7(CANH)
CAN_RX: U2.4(R) U3.21(PA11)
CAN_TX: U2.1(D) U3.22(PA12)
LED_B: D11.2(Anode) U3.29(PB6)
LED_R: D10.2(Anode) U3.30(PB7)
NRST: C16.2 P1.1 R33.1 U3.4(~{RST})
OSC_IN: C14.2 U3.2(PC14-OSC32_IN) XC1.1
OSC_OUT: R31.2 U3.3(PC15-OSC32_OUT)
SCL: R27.1 U3.19(PA9)
SDA: R29.1 U3.20(PA10)
SWCLK: P1.4 U3.24(PA14)
SWDIO: P1.3 U3.23(PA13)
SWO: P1.2 U3.26(PB3)
NetC15_2: C15.2 R31.1 XC1.1
NetD10_1: D10.1(Cathode) R28.1
NetD11_1: D11.1(Cathode) R30.1
NetD69_1: D69.1(Cathode) R69.1
NetR34_1: R34.1 U3.31(PH3/BOOT0)

Not connected (* = marked no-connect by the designer): U3 6(PA0/CK_IN)* 7(PA1)* 8(PA2)* 9(PA3)* 10(PA4)* 11(PA5)* 12(PA6)* 13(PA7)* 14(PB0)* 15(PB1)* 18(PA8) 28(PB5)*

### Layout directives
differential pair: CAN_N, CAN_P

### Notes on the sheet
- I2C Pullup Resistors
- CAN bus
- External Clock
- Programming
- (near C15) 2*(15pF-6pF)=18pF

### Library data of the parts
C13 = Capacitor: Manufacturer: Kyocera AVX; ComponentLink1Description: New link; ComponentLink1URL: *; Supplier 1: Mouser; Supplier Part Number 1: 581-06035C104JAT4A; Manufacturer Part Number: 06035C104JAT4A; RoHS: Yes; Category: Ceramic Capacitors; Stock 1: 26326; Pricing 1: 1=0.11000, 10=0.04300, 50=0.04300, 100=0.03500, 1000=0.02000, 10000=0.01400 (USD); RoHS Compliant: Yes
C14 C15 = Capacitor: Cap Ceramic 24pF 100V C0G 1% Pad SMD 0603 125°C Ultra Low ESR T/R; Manufacturer: Kyocera AVX; Temperature Coefficient: 30ppm/°C; ComponentLink1Description: New link; ComponentLink1URL: *; Supplier 1: Mouser; Supplier Part Number 1: 581-06031U240FAT2A; Manufacturer Part Number: 06031U240FAT2A; RoHS: Yes; Category: Ceramic Capacitors; Stock 1: 95996; Pricing 1: 1=0.41000, 10=0.28400, 50=0.28400, 100=0.16900, 1000=0.10700, 10000=0.07900 (USD); Mount: Surface Mount; Case/Package: 0603; Case Code (Metric): 1608; Case Code (Imperial): 0603; Weight: 7.1E-05oz; Min Operating Temperature: -55°C; Max Operating Temperature: 125°C; Capacitance: 24pF; Voltage Rating: 100V; Tolerance: 1%; Package Quantity: 4000; Packaging: Tape and Reel; Voltage Rating (DC): 100V; Dielectric: C0G; Termination: SMD/SMT; Resistor Type: Ceramic; Series: U; Construction: Flat; Length: 1.52mm; Width: 0.03inch; Thickness: 0.036inch; Depth: 0.76mm; Radiation Hardening: No; Lead Free: Lead Free; RoHS Compliant: Yes; ComponentLink2URL: https://datasheet.ciiva.com/208/useries-208498.pdf?src-supplier=Digi-Key; ComponentLink2Description: https://datasheet.ciiva.com/208/useries-208498.pdf?src-supplier=Digi-Key; ComponentLink3URL: https://datasheet.ciiva.com/11568/useries-11568149.pdf?src-supplier=Avnet; ComponentLink3Description: https://datasheet.ciiva.com/11568/useries-11568149.pdf?src-supplier=Avnet
C16 C22 C23 = Capacitor: as C6 on sheet bq76920 IC; Supplier 1: RSComponents; Supplier Part Number 1: 2053261; Manufacturer Part Number: C0603X104K5RAC7411; RoHS: Yes; Category: Ceramic Capacitors; Stock 1: 28600; Pricing 1: 15000=0.02900, 45000=0.02700 (USD); Mount: Surface Mount; Case/Package: 0603; Case Code (Metric): 1608; Case Code (Imperial): 0603; Min Operating Temperature: -55°C; Max Operating Temperature: 125°C; Capacitance: 100nF; Voltage Rating: 50V; Package Quantity: 1; Packaging: Cut Tape; Voltage Rating (DC): 50V; Features: Soft Termination; Length: 0.064inch; Width: 0.032inch; Thickness: 0.034inch; RoHS Compliant: Yes; ComponentLink1URL: https://api.kemet.com/component-edge/download/datasheet/C0603X104K5RAC7411.pdf?src-supplier=Digi-Key; ComponentLink1Description: https://api.kemet.com/component-edge/download/datasheet/C0603X104K5RAC7411.pdf?src-supplier=Digi-Key; ComponentLink2URL: http://www.farnell.com/datasheets/2747793.pdf?src-supplier=Newark; ComponentLink2Description: http://www.farnell.com/datasheets/2747793.pdf?src-supplier=Newark
C18 = Capacitor: Manufacturer: KEMET; Supplier 1: Mouser; Supplier Part Number 1: 80-C0603C105K9R7411; Manufacturer Part Number: C0603C105K9RAC7411; RoHS: Yes; Stock 1: 22716; Pricing 1: 1=0.25000, 10=0.10200, 50=0.10200, 100=0.08700, 1000=0.05300, 10000=0.04400 (USD); RoHS Compliant: Yes
C20 = Capacitor: 0603, 6.3V, X5R, 10 uF ± 10 %, T&R Q200 multilayer ceramic capacitor; Manufacturer: Taiyo Yuden; Supplier 1: Mouser; Supplier Part Number 1: 963-JMK107ABJ106KAHT; Manufacturer Part Number: JMK107ABJ106KAHT; RoHS: Yes; Category: Ceramic Capacitors; Stock 1: 12080; Pricing 1: 1=0.30000, 10=0.10600, 50=0.10600, 100=0.07200, 1000=0.04800, 10000=0.03500 (USD); RoHS Compliant: Yes
C24 = Capacitor: as C11 on sheet bq76920 IC; Supplier 1: Mouser; Supplier Part Number 1: 963-JMK107BB7475KA-T; Manufacturer Part Number: JMK107BB7475KA-T; RoHS: Yes; Category: Ceramic Capacitors; Stock 1: 75256; Pricing 1: 1=0.30000, 10=0.16700, 50=0.16700, 100=0.12200, 1000=0.10700, 10000=0.10100 (USD); Mount: Surface Mount; Case/Package: 0603; Case Code (Imperial): 0603; Case Code (Metric): 1608; Min Operating Temperature: -55°C; Max Operating Temperature: 125°C; Packaging: Cut Tape; Capacitance: 4.7uF; Tolerance: 10%; Voltage Rating: 6.3V; Lead Free: Lead Free; RoHS Compliant: Yes; ComponentLink1URL: http://www.farnell.com/datasheets/2801343.pdf?src-supplier=Farnell; ComponentLink1Description: http://www.farnell.com/datasheets/2801343.pdf?src-supplier=Farnell; ComponentLink2URL: http://ds.yuden.co.jp/TYCOMPAS/ut/detail.do?productNo=JMK107BB7475KA-T&fileName=JMK107BB7475KA-T_SS&mode=specSheetDownload&src-supplier=Digi-Key; ComponentLink2Description: http://ds.yuden.co.jp/TYCOMPAS/ut/detail.do?productNo=JMK107BB7475KA-T&fileName=JMK107BB7475KA-T_SS&mode=specSheetDownload&src-supplier=Digi-Key; ComponentLink3URL: https://ds.yuden.co.jp/TYCOMPAS/ut/detail?pn=JMK107BB7475KA-T &u=M&src-supplier=Digi-Key; ComponentLink3Description: https://ds.yuden.co.jp/TYCOMPAS/ut/detail?pn=JMK107BB7475KA-T &u=M&src-supplier=Digi-Key; ComponentLink4URL: http://www.farnell.com/datasheets/2801343.pdf?src-supplier=Element14; ComponentLink4Description: http://www.farnell.com/datasheets/2801343.pdf?src-supplier=Element14; ComponentLink5URL: http://www.farnell.com/datasheets/2801343.pdf?src-supplier=Newark; ComponentLink5Description: http://www.farnell.com/datasheets/2801343.pdf?src-supplier=Newark
D10 D69 = 150060RS55040: SMT Mono-color Chip LED Diffused
D11 = 150060BS55040: as D1 on sheet bq76920 IC; Supplier 1: Mouser; Manufacturer Part Number: 150060BS55040; RoHS: No; Pricing 1: 1=0.18000, 10=0.16200, 50=0.13200, 100=0.11700, 1000=0.08800, 10000=0.08800 (USD); Mount: Surface Mount; Case/Package: 0603; Color: Blue; Packaging: Tape and Reel; Lens Transparency: Diffused; Length: 1.6mm; Width: 0.8mm; Height: 0.5mm; RoHS Compliant: No; ComponentLink1URL: http://www.farnell.com/datasheets/2621640.pdf?src-supplier=Farnell; ComponentLink1Description: http://www.farnell.com/datasheets/2621640.pdf?src-supplier=Farnell; ComponentLink2URL: https://www.we-online.de/web/en/index.php/download/media/07_electronic_components/download_center_1/application_notes_berichte/ano002_leds___the_future_of_horticultural_lighting/ANO002b_EN_LEDs_The_Future_of_Horticultural_Lighting.pdf?src-supplier=Digi-Key; ComponentLink2Description: https://www.we-online.de/web/en/index.php/download/media/07_electronic_components/download_center_1/application_notes_berichte/ano002_leds___the_future_of_horticultural_lighting/ANO002b_EN_LEDs_The_Future_of_Horticultural_Lighting.pdf?src-supplier=Digi-Key; ComponentLink3URL: https://katalog.we-online.de/pbs/datasheet/150060BS55040.pdf?src-supplier=Digi-Key; ComponentLink3Description: https://katalog.we-online.de/pbs/datasheet/150060BS55040.pdf?src-supplier=Digi-Key; Supplier Part Number 1: 710-150060BS55040
D12 = CMP-07200-000005-1: TVS DIODE 32V 66V SOT23-3; Manufacturer: ON Semiconductor; Capacitance: 30pF; Max Junction Temp: +150°C; Standoff Height: 0.01mm; Peak Pulse Power: 350W; Breakdown Voltage: 35.6V; Automotive Grade: Grade 0; Number Of Channels: 2; Value: 30pF; Direction: Bidirectional; Peak Pulse Current: 8A; Height: 1.11mm; Mouser Description: 32V Dual Line CAN Bus Protector in SOT-23 AEC-Q 24 V CAN Bus Protector in SOT-23; Device Class L3: unset; Clamping Voltage: 66V; Manufacturer Part Number: SZNUP3105LT3G; ComponentLink2Description: Datasheet; Octopart: https://octopart.com/sznup3105lt3g-on+semiconductor-54318507; Temperature Range High: +150°C; Reverse Standoff Voltage: 32V; RoHS: TRUE; Package: 318-08; Device Class L2: TVS Diodes; Device Class L1: Circuit Protection; Temperature Range Low: -55°C; Lead Free: Yes; Temperature: -55°C to +150°C; ComponentLink2URL: https://www.onsemi.com/pub/Collateral/NUP3105L-D.PDF; Automotive: Yes; Footprint Url: https://www.onsemi.com/pub/Collateral/318-08.PDF; Digikey Description: TVS DIODE 32V 66V SOT23-3; Category: Diode
P1 = MHDR2X3: Header, 3-Pin, Dual row; LatestRevisionDate: 17-Jul-2002; LatestRevisionNote: Re-released for DXP Platform.; Publisher: Altium Limited
P2 = MHDR1X2: Header, 2-Pin; LatestRevisionDate: 17-Jul-2002; LatestRevisionNote: Re-released for DXP Platform.; Publisher: Altium Limited
R27 R29 = Resistor: Manufacturer: Vishay; Supplier 1: Mouser; Supplier Part Number 1: 71-CRCW06031K10JNEAC; Manufacturer Part Number: CRCW06031K10JNEAC; RoHS: Yes; Category: Chip SMD Resistors; Stock 1: 51915; Pricing 1: 1=0.10000, 10=0.03000, 50=0.03000, 100=0.01200, 1000=0.00500, 10000=0.00300 (USD); RoHS Compliant: Yes
R28 R69 = Resistor: High Precision-High Stability Chip Resistor Thin Film 0603 583Ohm 0.5% Paper T/R; Manufacturer: Yageo; Max Power Dissipation: 100mW; Temperature Coefficient: 50ppm/°C; Resistance: 583R; Supplier 1: Mouser; Supplier Part Number 1: 603-RT0603DRE07583RL; Manufacturer Part Number: RT0603DRE07583RL; RoHS: Yes; Category: Chip SMD Resistors; Stock 1: 17347; Pricing 1: 1=0.14000, 10=0.07400, 50=0.07400, 100=0.02600, 1000=0.01900, 10000=0.01200 (USD); Case/Package: 0603; Min Operating Temperature: -55°C; Max Operating Temperature: 155°C; Resistor Type: Thin Film; Packaging: Tape and Reel; Number of Terminations: 2; Tolerance: 0.5%; ComponentLink1URL: http://www.yageo.com/documents/recent/PYu-RT_1-to-0.01_RoHS_L_9.pdf?src-supplier=Digi-Key; ComponentLink1Description: http://www.yageo.com/documents/recent/PYu-RT_1-to-0.01_RoHS_L_9.pdf?src-supplier=Digi-Key
R30 = Resistor: as R5 on sheet bq76920 IC; Supplier 1: Mouser; Supplier Part Number 1: 603-RT0603DRE07583RL; Manufacturer Part Number: RT0603DRE07583RL; RoHS: Yes; Category: Chip SMD Resistors; Stock 1: 17347; Pricing 1: 1=0.14000, 10=0.07400, 50=0.07400, 100=0.02600, 1000=0.01900, 10000=0.01200 (USD); Case/Package: 0603; Min Operating Temperature: -55°C; Max Operating Temperature: 155°C; Resistor Type: Thin Film; Packaging: Tape and Reel; Number of Terminations: 2; Resistance: 583R; Tolerance: 0.5%; ComponentLink1URL: http://www.yageo.com/documents/recent/PYu-RT_1-to-0.01_RoHS_L_9.pdf?src-supplier=Digi-Key; ComponentLink1Description: http://www.yageo.com/documents/recent/PYu-RT_1-to-0.01_RoHS_L_9.pdf?src-supplier=Digi-Key
R32 = Resistor: Bus termination resistor
R33 R34 = Resistor: Manufacturer: Bourns; Supplier 1: Mouser; Supplier Part Number 1: 652-CMP0603AFX-1002L; Manufacturer Part Number: CMP0603AFX-1002ELF; RoHS: No; Stock 1: 10216; Pricing 1: 1=0.21000, 10=0.09200, 50=0.09200, 100=0.05300, 1000=0.02900, 10000=0.02200 (USD)
U2 = CMP-0315-00036-2: 3.3V CAN Transceiver with Standby Mode, Loop-back, 6 mA, -40 to 125 degC, 8-pin SOIC (D), Green (RoHS & no Sb/Br); Manufacturer: Texas Instruments; Receivers Per Package: 1; Bus Fault Voltage(V): +/-30; Rating: Catalog; ICC(Max)(mA): 6; Supply Voltage(s)(V): 3.3; Transient Pulse Protection(V): -100 to 100; PackageVersion: revM, Jun-2011; PackageReference: D0008A; ComponentLink1Description: Datasheet; Isolated: No; Footprint: PCA82C250, excludes pin5; DatasheetVersion: SLLS557F; PackageDescription: 8-Pin Plastic Small Outline Integrated Circuit, 4.9 x 3.9 mm, Pitch 1.27 mm Pitch; Features: Loop Back; Low Power Mode: Standby; SubFamily: CAN; Drivers Per Package: 1; Eco-Plan: Green (RoHS & no Sb/Br); ComponentLink1URL: http://www.ti.com/general/docs/lit/getliterature.tsp?genericPartNumber=SN65HVD233&fileType=pdf; PartNumber: SN65HVD233D; Code_JEDEC: MS-012AA; Mounting Technology: Surface Mount
U3 = CMP-12105-000014-1: IC MCU 32BIT 128KB FLASH 32QFPN; Manufacturer: STMicroelectronics; Memory Size: 128KBytes; Number Of I/Os: 26; Max Supply Voltage: 3.6V; Core Architecture: ARM Cortex-M4; Number Of A/D Converters: 1; Number Of Timers/Counters: 8; Min Supply Voltage: 1.62V; Interface: I2C,SPI,UART,USART,USB,IrDA; Number Of Spi Channels: 2; Frequency: 80MHz; Max Junction Temp: +105°C; Number Of Adc Channels: 10; Ram Size: 64KBytes; Data Bus Width: 32bits; Ambient Temperature Range High: +85°C; Device Class L2: Embedded Processors and Controllers; Temperature: -40°C to +85°C; Category: IC; ComponentLink2URL: https://www.st.com/resource/en/datasheet/stm32l432kb.pdf; Device Class L1: Integrated Circuits (ICs); ComponentLink2Description: Datasheet; Memory Type: FLASH; Ipc Land Pattern Name: QFN50P500X500X55-32; Temperature Range Low: -40°C; Height: 0.6mm; Digikey Description: IC MCU 32BIT 128KB FLASH 32QFPN; Temperature Range High: +85°C; Device Class L3: Microcontrollers; Lead Free: Yes; RoHS: TRUE; Octopart: https://octopart.com/stm32l432kbu6-stmicroelectronics-74568735; Manufacturer Part Number: STM32L432KBU6; Number Of Uart Channels: 1; Ambient Temperature Range Low: -40°C; Package: UFQFPN32-A0B8; Number Of I2C Channels: 2; Number Of Cores: 1; Automotive: No
XC1 = ATS600BSM-1E: CRYSTAL 60.0000MHZ 18PF SMD; Manufacturer: CTS; Frequency: 60MHz; Tolerance: 30ppm; ESR (Equivalent Series Resistance): 80R; Frequency Stability: 50ppm; Supplier 1: Mouser; Manufacturer Part Number: ATS600BSM-1E; RoHS: Yes; Category: Crystals; Stock 1: 862; Pricing 1: 1=0.44000, 10=0.34000, 50=0.34000, 100=0.30200, 1000=0.23000, 10000=0.20200 (USD); Mount: Surface Mount; Number of Pins: 2; Contact Plating: Copper,Tin,Silver; Min Operating Temperature: -40°C; Max Operating Temperature: 85°C; Packaging: Tape and Reel; Load Capacitance: 18pF; Package Quantity: 1000; Frequency Tolerance: 30ppm; Termination: SMD/SMT; Series: ATS-SM; Length: 0.437inch; Width: 3.8mm; Height: 0.169inch; RoHS Compliant: Yes; ComponentLink1URL: https://datasheet.ciiva.com/861/008-0309-0-861343.pdf?src-supplier=Digi-Key; ComponentLink1Description: https://datasheet.ciiva.com/861/008-0309-0-861343.pdf?src-supplier=Digi-Key; ComponentLink2URL: https://datasheet.ciiva.com/3176/008-0309-0-3176665.pdf?src-supplier=Avnet; ComponentLink2Description: https://datasheet.ciiva.com/3176/008-0309-0-3176665.pdf?src-supplier=Avnet; ComponentLink3URL: https://datasheet.ciiva.com/4949/008-0309-0-32667-4949738.pdf?src-supplier=Mouser; ComponentLink3Description: https://datasheet.ciiva.com/4949/008-0309-0-32667-4949738.pdf?src-supplier=Mouser; Supplier Part Number 1: 774-ATS600BSM-1E

## Nets that join several sheets
GND: bq76920 IC (14 pins), MCU (20 pins)
VCC: bq76920 IC (C11.2 U1.8), MCU (15 pins)
ALERT: bq76920 IC (R35.1 U1.20), MCU (U3.25)
SCL: bq76920 IC (U1.5), MCU (R27.1 U3.19)
SDA: bq76920 IC (U1.4), MCU (R29.1 U3.20)